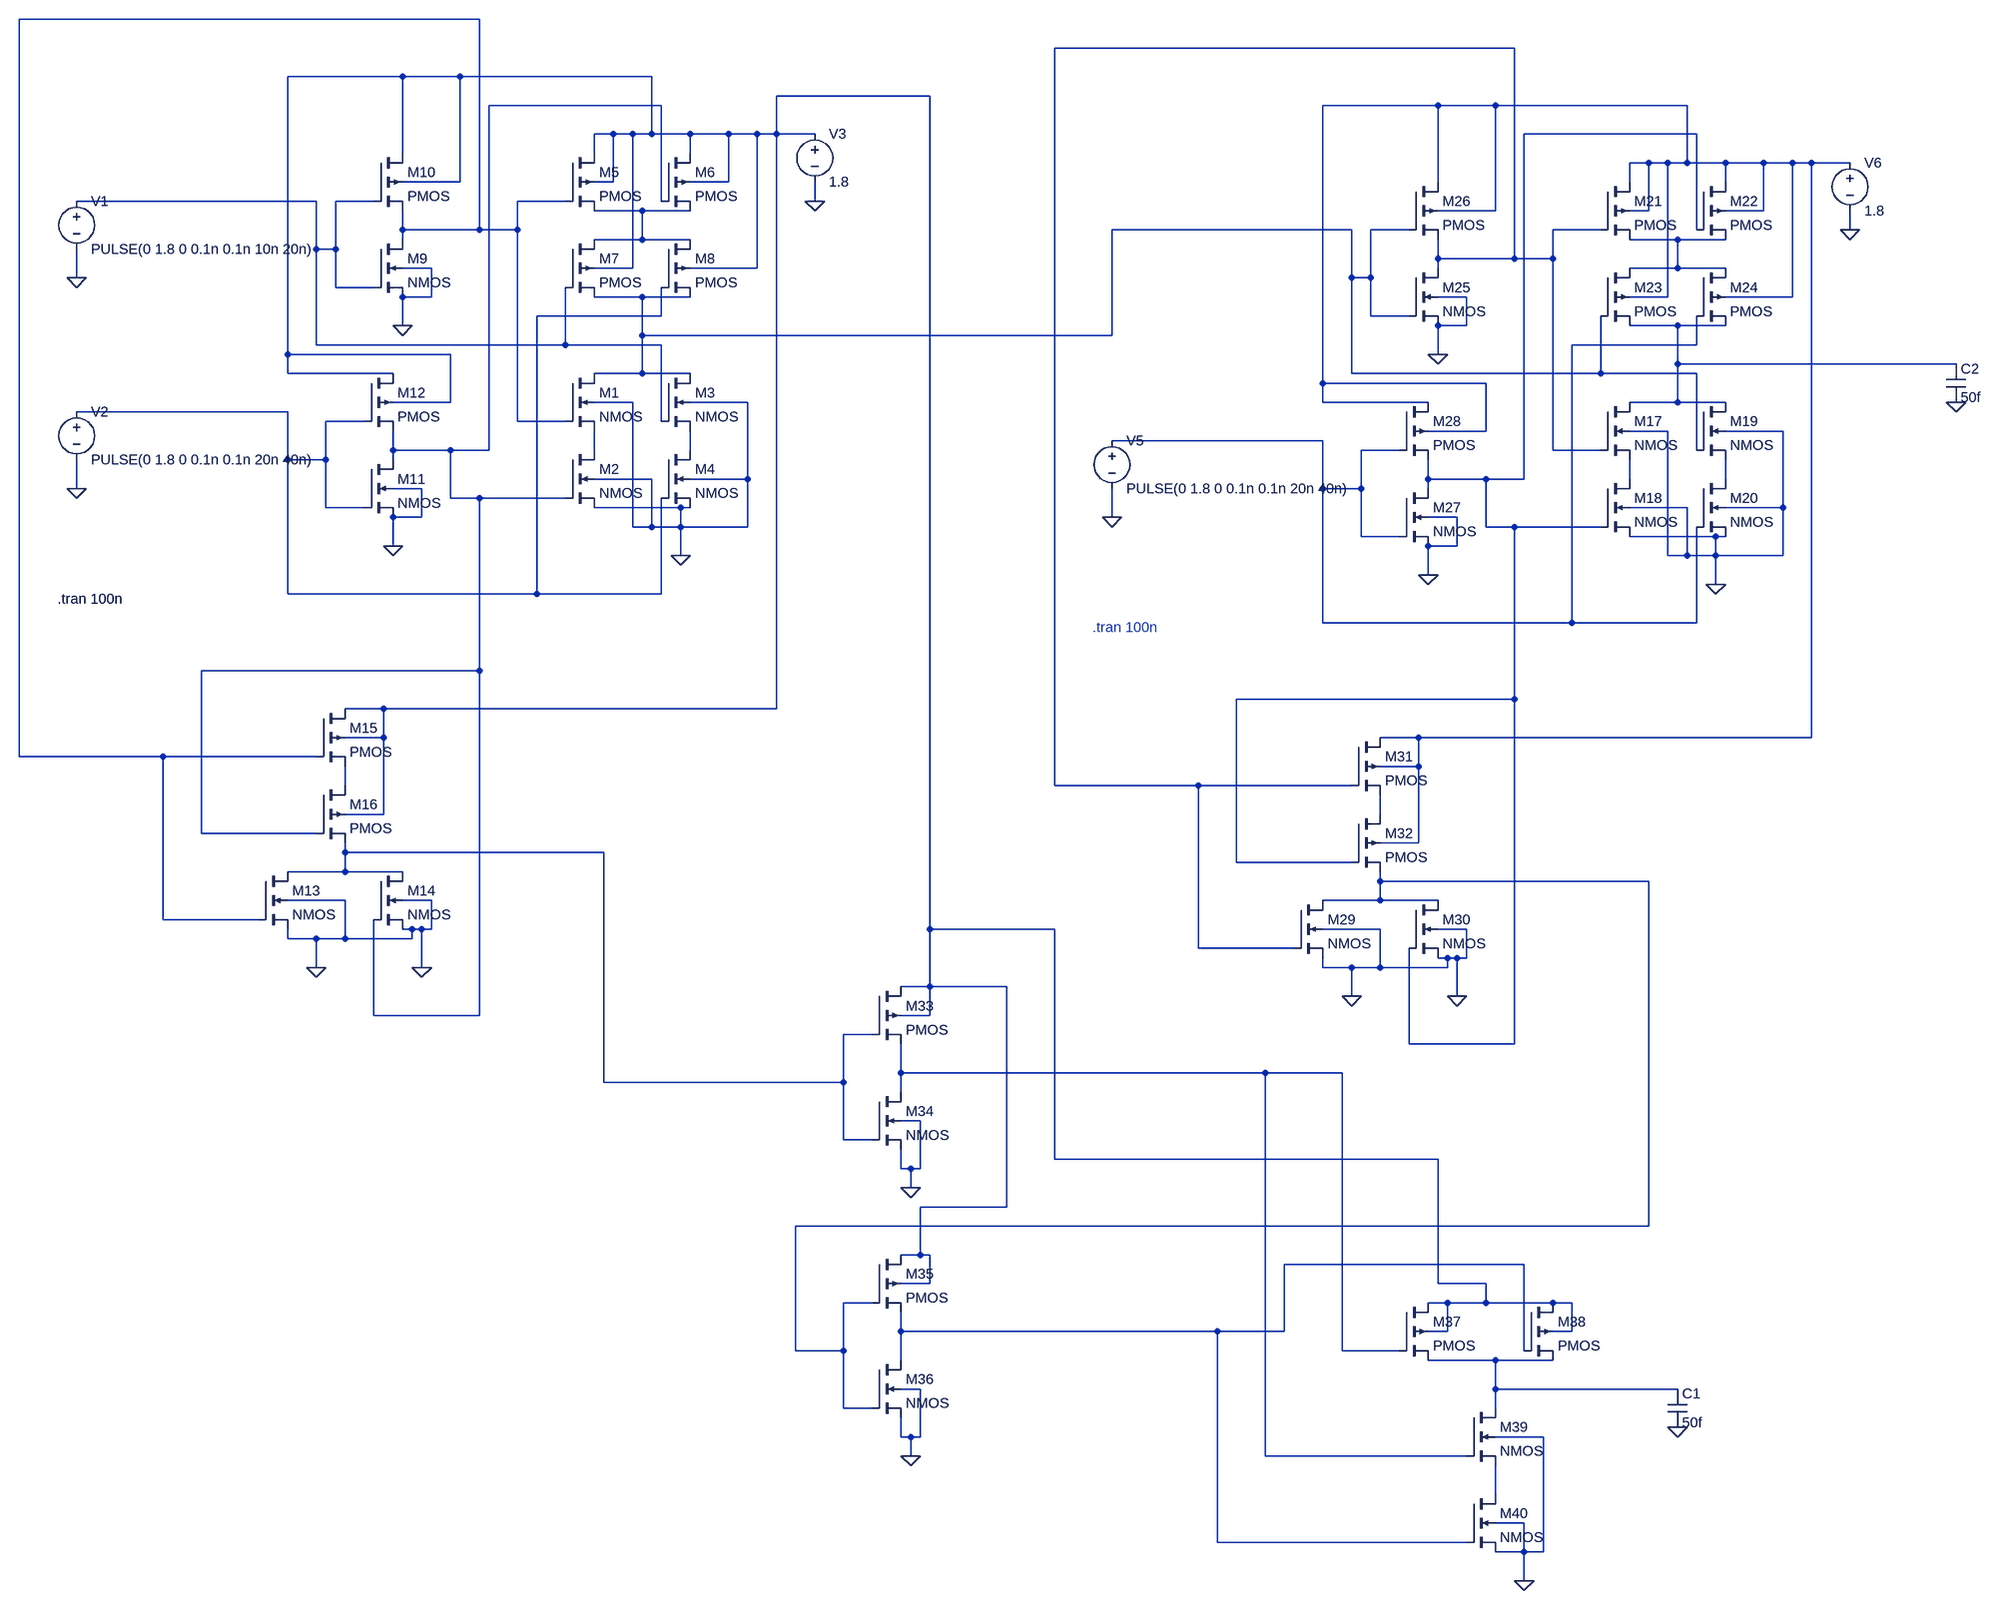
[diagram p0: schematic full adder.asc]
full adder.asc, the LTspice schematic file:
Version 4.1
SHEET 1 2688 2308
WIRE 16 -320 -752 -320
WIRE 1744 -272 976 -272
WIRE -112 -224 -304 -224
WIRE -16 -224 -112 -224
WIRE 304 -224 -16 -224
WIRE 768 -192 512 -192
WIRE 320 -176 32 -176
WIRE 1616 -176 1424 -176
WIRE 1712 -176 1616 -176
WIRE 2032 -176 1712 -176
WIRE 240 -128 208 -128
WIRE 272 -128 240 -128
WIRE 304 -128 304 -224
WIRE 304 -128 272 -128
WIRE 368 -128 304 -128
WIRE 432 -128 368 -128
WIRE 480 -128 432 -128
WIRE 512 -128 512 -192
WIRE 512 -128 480 -128
WIRE 576 -128 512 -128
WIRE 2048 -128 1760 -128
WIRE -112 -96 -112 -224
WIRE 208 -96 208 -128
WIRE 368 -96 368 -128
WIRE 1968 -80 1936 -80
WIRE 2000 -80 1968 -80
WIRE 2032 -80 2032 -176
WIRE 2032 -80 2000 -80
WIRE 2096 -80 2032 -80
WIRE 2160 -80 2096 -80
WIRE 2208 -80 2160 -80
WIRE 2240 -80 2208 -80
WIRE 2304 -80 2240 -80
WIRE -16 -48 -16 -224
WIRE -16 -48 -112 -48
WIRE 240 -48 240 -128
WIRE 240 -48 208 -48
WIRE 432 -48 432 -128
WIRE 432 -48 368 -48
WIRE 1616 -48 1616 -176
WIRE 1936 -48 1936 -80
WIRE 2096 -48 2096 -80
WIRE -256 -16 -656 -16
WIRE -160 -16 -224 -16
WIRE 160 -16 80 -16
WIRE 320 -16 320 -176
WIRE 576 -16 576 -48
WIRE 288 0 208 0
WIRE 368 0 288 0
WIRE 1712 0 1712 -176
WIRE 1712 0 1616 0
WIRE 1968 0 1968 -80
WIRE 1968 0 1936 0
WIRE 2160 0 2160 -80
WIRE 2160 0 2096 0
WIRE -112 32 -112 0
WIRE 16 32 16 -320
WIRE 16 32 -112 32
WIRE 80 32 80 -16
WIRE 80 32 16 32
WIRE 1472 32 1072 32
WIRE 1568 32 1504 32
WIRE 1888 32 1808 32
WIRE 2048 32 2048 -128
WIRE 2304 32 2304 0
WIRE -112 48 -112 32
WIRE 288 48 288 0
WIRE 288 48 208 48
WIRE 368 48 288 48
WIRE 2016 48 1936 48
WIRE 2096 48 2016 48
WIRE -256 64 -256 -16
WIRE -224 64 -224 -16
WIRE -224 64 -256 64
WIRE 1616 80 1616 48
WIRE 1744 80 1744 -272
WIRE 1744 80 1616 80
WIRE 1808 80 1808 32
WIRE 1808 80 1744 80
WIRE -64 96 -112 96
WIRE 272 96 272 -128
WIRE 272 96 208 96
WIRE 480 96 480 -128
WIRE 480 96 368 96
WIRE 1616 96 1616 80
WIRE 2016 96 2016 48
WIRE 2016 96 1936 96
WIRE 2096 96 2016 96
WIRE -656 112 -656 64
WIRE 1472 112 1472 32
WIRE 1504 112 1504 32
WIRE 1504 112 1472 112
WIRE -224 128 -224 64
WIRE -160 128 -224 128
WIRE -64 144 -64 96
WIRE -64 144 -112 144
WIRE 288 144 208 144
WIRE 368 144 288 144
WIRE 1664 144 1616 144
WIRE 2000 144 2000 -80
WIRE 2000 144 1936 144
WIRE 2208 144 2208 -80
WIRE 2208 144 2096 144
WIRE 320 176 320 128
WIRE 320 176 112 176
WIRE 1504 176 1504 112
WIRE 1568 176 1504 176
WIRE -112 192 -112 144
WIRE 1664 192 1664 144
WIRE 1664 192 1616 192
WIRE 2016 192 1936 192
WIRE 2096 192 2016 192
WIRE 288 208 288 144
WIRE 1072 208 1072 32
WIRE 1072 208 288 208
WIRE -256 224 -256 64
WIRE 160 224 160 128
WIRE 160 224 -256 224
WIRE 320 224 160 224
WIRE 2048 224 2048 176
WIRE 2048 224 1840 224
WIRE -304 240 -304 -224
WIRE -32 240 -304 240
WIRE 1616 240 1616 192
WIRE 2016 256 2016 192
WIRE 2576 256 2016 256
WIRE -304 272 -304 240
WIRE -128 272 -304 272
WIRE 288 272 288 208
WIRE 288 272 208 272
WIRE 368 272 288 272
WIRE 1472 272 1472 112
WIRE 1888 272 1888 176
WIRE 1888 272 1472 272
WIRE 2048 272 1888 272
WIRE 1424 288 1424 -176
WIRE 1696 288 1424 288
WIRE -32 320 -32 240
WIRE -32 320 -128 320
WIRE 272 320 208 320
WIRE 464 320 368 320
WIRE 1424 320 1424 288
WIRE 1600 320 1424 320
WIRE 2016 320 2016 256
WIRE 2016 320 1936 320
WIRE 2096 320 2016 320
WIRE -304 336 -656 336
WIRE -176 352 -240 352
WIRE 80 352 80 32
WIRE 160 352 80 352
WIRE 320 352 320 224
WIRE 1696 368 1696 288
WIRE 1696 368 1600 368
WIRE 2000 368 1936 368
WIRE 2192 368 2096 368
WIRE 1424 384 1072 384
WIRE -128 400 -128 368
WIRE -32 400 -128 400
WIRE 32 400 32 -176
WIRE 32 400 -32 400
WIRE 208 400 208 368
WIRE 368 400 368 368
WIRE 1552 400 1488 400
WIRE 1808 400 1808 80
WIRE 1888 400 1808 400
WIRE 2048 400 2048 272
WIRE -304 416 -304 336
WIRE -240 416 -240 352
WIRE -240 416 -304 416
WIRE -128 416 -128 400
WIRE 304 448 208 448
WIRE 464 448 464 320
WIRE 464 448 368 448
WIRE 1600 448 1600 416
WIRE 1696 448 1600 448
WIRE 1760 448 1760 -128
WIRE 1760 448 1696 448
WIRE 1936 448 1936 416
WIRE 2096 448 2096 416
WIRE -656 464 -656 416
WIRE -80 464 -128 464
WIRE 1424 464 1424 384
WIRE 1488 464 1488 400
WIRE 1488 464 1424 464
WIRE 1600 464 1600 448
WIRE -32 480 -32 400
WIRE 16 480 -32 480
WIRE 160 480 16 480
WIRE -240 496 -240 416
WIRE -176 496 -240 496
WIRE 352 496 208 496
WIRE 368 496 352 496
WIRE 2032 496 1936 496
WIRE 2192 496 2192 368
WIRE 2192 496 2096 496
WIRE -80 512 -80 464
WIRE -80 512 -128 512
WIRE 1072 512 1072 464
WIRE 1648 512 1600 512
WIRE 272 528 272 320
WIRE 304 528 304 448
WIRE 304 528 272 528
WIRE 352 528 352 496
WIRE 352 528 304 528
WIRE 464 528 464 448
WIRE 464 528 352 528
WIRE 1696 528 1696 448
WIRE 1744 528 1696 528
WIRE 1888 528 1744 528
WIRE 1488 544 1488 464
WIRE 1552 544 1488 544
WIRE 2080 544 1936 544
WIRE 2096 544 2080 544
WIRE -128 560 -128 512
WIRE 1648 560 1648 512
WIRE 1648 560 1600 560
WIRE 352 576 352 528
WIRE 2000 576 2000 368
WIRE 2032 576 2032 496
WIRE 2032 576 2000 576
WIRE 2080 576 2080 544
WIRE 2080 576 2032 576
WIRE 2192 576 2192 496
WIRE 2192 576 2080 576
WIRE 1600 608 1600 560
WIRE 2080 624 2080 576
WIRE -304 640 -304 416
WIRE 112 640 112 176
WIRE 112 640 -304 640
WIRE 320 640 320 480
WIRE 320 640 112 640
WIRE 1424 688 1424 464
WIRE 1840 688 1840 224
WIRE 1840 688 1424 688
WIRE 2048 688 2048 528
WIRE 2048 688 1840 688
WIRE 16 768 16 480
WIRE 16 768 -448 768
WIRE 1744 816 1744 528
WIRE 1744 816 1280 816
WIRE -144 832 -208 832
WIRE 512 832 512 -128
WIRE 512 832 -144 832
WIRE -144 880 -144 832
WIRE -144 880 -208 880
WIRE 1584 880 1520 880
WIRE 2240 880 2240 -80
WIRE 2240 880 1584 880
WIRE -752 912 -752 -320
WIRE -512 912 -752 912
WIRE -256 912 -512 912
WIRE 1584 928 1584 880
WIRE 1584 928 1520 928
WIRE -208 960 -208 928
WIRE 976 960 976 -272
WIRE 1216 960 976 960
WIRE 1472 960 1216 960
WIRE -144 1008 -144 880
WIRE -144 1008 -208 1008
WIRE 1520 1008 1520 976
WIRE -448 1040 -448 768
WIRE -256 1040 -448 1040
WIRE 1584 1056 1584 928
WIRE 1584 1056 1520 1056
WIRE -208 1072 -208 1056
WIRE 224 1072 -208 1072
WIRE 1280 1088 1280 816
WIRE 1472 1088 1280 1088
WIRE -208 1104 -208 1072
WIRE -208 1104 -304 1104
WIRE -112 1104 -208 1104
WIRE 1520 1120 1520 1104
WIRE 1968 1120 1520 1120
WIRE -208 1152 -304 1152
WIRE -64 1152 -112 1152
WIRE 1520 1152 1520 1120
WIRE 1520 1152 1424 1152
WIRE 1616 1152 1520 1152
WIRE -512 1184 -512 912
WIRE -352 1184 -512 1184
WIRE -96 1200 -112 1200
WIRE -80 1200 -96 1200
WIRE -64 1200 -64 1152
WIRE -64 1200 -80 1200
WIRE 768 1200 768 -192
WIRE 976 1200 768 1200
WIRE 1520 1200 1424 1200
WIRE 1664 1200 1616 1200
WIRE -304 1216 -304 1200
WIRE -256 1216 -304 1216
WIRE -208 1216 -208 1152
WIRE -208 1216 -256 1216
WIRE -96 1216 -96 1200
WIRE -96 1216 -208 1216
WIRE 1216 1232 1216 960
WIRE 1376 1232 1216 1232
WIRE 1632 1248 1616 1248
WIRE 1648 1248 1632 1248
WIRE 1664 1248 1664 1200
WIRE 1664 1248 1648 1248
WIRE -256 1264 -256 1216
WIRE -80 1264 -80 1200
WIRE 1424 1264 1424 1248
WIRE 1472 1264 1424 1264
WIRE 1520 1264 1520 1200
WIRE 1520 1264 1472 1264
WIRE 1632 1264 1632 1248
WIRE 1632 1264 1520 1264
WIRE 768 1296 768 1200
WIRE 768 1296 720 1296
WIRE 896 1296 768 1296
WIRE 1472 1312 1472 1264
WIRE 1648 1312 1648 1248
WIRE -160 1344 -160 1184
WIRE 16 1344 16 768
WIRE 16 1344 -160 1344
WIRE 768 1344 768 1296
WIRE 768 1344 720 1344
WIRE 672 1376 624 1376
WIRE 1568 1392 1568 1232
WIRE 1744 1392 1744 816
WIRE 1744 1392 1568 1392
WIRE 720 1440 720 1392
WIRE 1328 1440 720 1440
WIRE 1456 1440 1328 1440
WIRE 224 1456 224 1072
WIRE 624 1456 624 1376
WIRE 624 1456 224 1456
WIRE 720 1472 720 1440
WIRE 752 1520 720 1520
WIRE 624 1552 624 1456
WIRE 672 1552 624 1552
WIRE 976 1584 976 1200
WIRE 1616 1584 976 1584
WIRE 720 1600 720 1568
WIRE 736 1600 720 1600
WIRE 752 1600 752 1520
WIRE 752 1600 736 1600
WIRE 736 1632 736 1600
WIRE 896 1664 896 1296
WIRE 896 1664 752 1664
WIRE 1968 1696 1968 1120
WIRE 1968 1696 544 1696
WIRE 752 1744 752 1664
WIRE 752 1744 720 1744
WIRE 768 1744 752 1744
WIRE 1760 1760 1360 1760
WIRE 768 1792 768 1744
WIRE 768 1792 720 1792
WIRE 1616 1792 1616 1584
WIRE 1696 1792 1616 1792
WIRE 672 1824 624 1824
WIRE 1632 1824 1600 1824
WIRE 1696 1824 1696 1792
WIRE 1696 1824 1632 1824
WIRE 1808 1824 1696 1824
WIRE 1840 1824 1808 1824
WIRE 720 1872 720 1840
WIRE 1248 1872 720 1872
WIRE 1360 1872 1360 1760
WIRE 1360 1872 1248 1872
WIRE 1632 1872 1632 1824
WIRE 1632 1872 1600 1872
WIRE 1840 1872 1840 1824
WIRE 1840 1872 1808 1872
WIRE 544 1904 544 1696
WIRE 624 1904 624 1824
WIRE 624 1904 544 1904
WIRE 1456 1904 1456 1440
WIRE 1552 1904 1456 1904
WIRE 1760 1904 1760 1760
WIRE 720 1920 720 1872
WIRE 1712 1920 1600 1920
WIRE 1808 1920 1712 1920
WIRE 752 1968 720 1968
WIRE 1712 1968 1712 1920
WIRE 2016 1968 1712 1968
WIRE 624 2000 624 1904
WIRE 672 2000 624 2000
WIRE 1712 2000 1712 1968
WIRE 720 2048 720 2016
WIRE 736 2048 720 2048
WIRE 752 2048 752 1968
WIRE 752 2048 736 2048
WIRE 1792 2048 1712 2048
WIRE 736 2080 736 2048
WIRE 1328 2080 1328 1440
WIRE 1664 2080 1328 2080
WIRE 1712 2144 1712 2096
WIRE 1760 2192 1712 2192
WIRE 1248 2224 1248 1872
WIRE 1664 2224 1248 2224
WIRE 1760 2240 1760 2192
WIRE 1760 2240 1712 2240
WIRE 1792 2240 1792 2048
WIRE 1792 2240 1760 2240
WIRE 1760 2288 1760 2240
FLAG -112 192 0
FLAG -128 560 0
FLAG 352 576 0
FLAG -656 112 0
FLAG -656 464 0
FLAG 576 -16 0
FLAG -256 1264 0
FLAG -80 1264 0
FLAG 1616 240 0
FLAG 1600 608 0
FLAG 2080 624 0
FLAG 1072 512 0
FLAG 2304 32 0
FLAG 1472 1312 0
FLAG 1648 1312 0
FLAG 736 1632 0
FLAG 736 2080 0
FLAG 1760 2288 0
FLAG 2016 2032 0
FLAG 2576 320 0
SYMBOL nmos4 160 272 R0
SYMATTR InstName M1
SYMATTR Value2 l=180n w=270n
SYMBOL nmos4 160 400 R0
SYMATTR InstName M2
SYMATTR Value2 l=180n w=270n
SYMBOL nmos4 320 272 R0
SYMATTR InstName M3
SYMATTR Value2 l=180n w=270n
SYMBOL nmos4 320 400 R0
SYMATTR InstName M4
SYMATTR Value2 l=180n w=270n
SYMBOL pmos4 160 -96 R0
SYMATTR InstName M5
SYMATTR Value2 l=180n w=810n
SYMBOL pmos4 320 -96 R0
SYMATTR InstName M6
SYMATTR Value2 l=180n w=810n
SYMBOL pmos4 160 48 R0
SYMATTR InstName M7
SYMATTR Value2 l=180n w=810n
SYMBOL pmos4 320 48 R0
SYMATTR InstName M8
SYMATTR Value2 l=180n w=810n
SYMBOL nmos4 -160 48 R0
SYMATTR InstName M9
SYMATTR Value2 l=180n w=270n
SYMBOL pmos4 -160 -96 R0
SYMATTR InstName M10
SYMATTR Value2 l=180n w=810n
SYMBOL nmos4 -176 416 R0
SYMATTR InstName M11
SYMATTR Value2 l=180n w=270n
SYMBOL pmos4 -176 272 R0
SYMATTR InstName M12
SYMATTR Value2 l=180n w=810n
SYMBOL voltage -656 -32 R0
WINDOW 123 0 0 Left 0
WINDOW 39 0 0 Left 0
SYMATTR InstName V1
SYMATTR Value PULSE(0 1.8 0 0.1n 0.1n 10n 20n)
SYMBOL voltage -656 320 R0
WINDOW 123 0 0 Left 0
WINDOW 39 0 0 Left 0
SYMATTR InstName V2
SYMATTR Value PULSE(0 1.8 0 0.1n 0.1n 20n 40n)
SYMBOL voltage 576 -144 R0
WINDOW 123 0 0 Left 0
WINDOW 39 0 0 Left 0
SYMATTR InstName V3
SYMATTR Value 1.8
SYMBOL nmos4 -352 1104 R0
SYMATTR InstName M13
SYMATTR Value2 l=180n w=270n
SYMBOL nmos4 -160 1104 R0
SYMATTR InstName M14
SYMATTR Value2 l=180n w=270n
SYMBOL pmos4 -256 832 R0
SYMATTR InstName M15
SYMATTR Value2 l=180n w=810n
SYMBOL pmos4 -256 960 R0
SYMATTR InstName M16
SYMATTR Value2 l=180n w=810n
SYMBOL nmos4 1888 320 R0
SYMATTR InstName M17
SYMATTR Value2 l=180n w=270n
SYMBOL nmos4 1888 448 R0
SYMATTR InstName M18
SYMATTR Value2 l=180n w=270n
SYMBOL nmos4 2048 320 R0
SYMATTR InstName M19
SYMATTR Value2 l=180n w=270n
SYMBOL nmos4 2048 448 R0
SYMATTR InstName M20
SYMATTR Value2 l=180n w=270n
SYMBOL pmos4 1888 -48 R0
SYMATTR InstName M21
SYMATTR Value2 l=180n w=810n
SYMBOL pmos4 2048 -48 R0
SYMATTR InstName M22
SYMATTR Value2 l=180n w=810n
SYMBOL pmos4 1888 96 R0
SYMATTR InstName M23
SYMATTR Value2 l=180n w=810n
SYMBOL pmos4 2048 96 R0
SYMATTR InstName M24
SYMATTR Value2 l=180n w=810n
SYMBOL nmos4 1568 96 R0
SYMATTR InstName M25
SYMATTR Value2 l=180n w=270n
SYMBOL pmos4 1568 -48 R0
SYMATTR InstName M26
SYMATTR Value2 l=180n w=810n
SYMBOL nmos4 1552 464 R0
SYMATTR InstName M27
SYMATTR Value2 l=180n w=270n
SYMBOL pmos4 1552 320 R0
SYMATTR InstName M28
SYMATTR Value2 l=180n w=810n
SYMBOL voltage 1072 368 R0
WINDOW 123 0 0 Left 0
WINDOW 39 0 0 Left 0
SYMATTR InstName V5
SYMATTR Value PULSE(0 1.8 0 0.1n 0.1n 20n 40n)
SYMBOL voltage 2304 -96 R0
WINDOW 123 0 0 Left 0
WINDOW 39 0 0 Left 0
SYMATTR InstName V6
SYMATTR Value 1.8
SYMBOL nmos4 1376 1152 R0
SYMATTR InstName M29
SYMATTR Value2 l=180n w=270n
SYMBOL nmos4 1568 1152 R0
SYMATTR InstName M30
SYMATTR Value2 l=180n w=270n
SYMBOL pmos4 1472 880 R0
SYMATTR InstName M31
SYMATTR Value2 l=180n w=810n
SYMBOL pmos4 1472 1008 R0
SYMATTR InstName M32
SYMATTR Value2 l=180n w=810n
SYMBOL pmos4 672 1296 R0
SYMATTR InstName M33
SYMATTR Value2 l=180n w=810n
SYMBOL nmos4 672 1472 R0
SYMATTR InstName M34
SYMATTR Value2 l=180n w=270n
SYMBOL pmos4 672 1744 R0
SYMATTR InstName M35
SYMATTR Value2 l=180n w=810n
SYMBOL nmos4 672 1920 R0
SYMATTR InstName M36
SYMATTR Value2 l=180n w=270n
SYMBOL pmos4 1552 1824 R0
SYMATTR InstName M37
SYMATTR Value2 l=180n w=810n
SYMBOL pmos4 1760 1824 R0
SYMATTR InstName M38
SYMATTR Value2 l=180n w=810n
SYMBOL nmos4 1664 2000 R0
SYMATTR InstName M39
SYMATTR Value2 l=180n w=270n
SYMBOL nmos4 1664 2144 R0
SYMATTR InstName M40
SYMATTR Value2 l=180n w=270n
SYMBOL cap 2000 1968 R0
SYMATTR InstName C1
SYMATTR Value 50f
SYMBOL cap 2560 256 R0
SYMATTR InstName C2
SYMATTR Value 50f
TEXT -688 648 Left 2 !.tran 100n
TEXT 1040 696 Left 2 ;.tran 100n

The netlist it stands for:
* full adder.asc
M1 N009 N001 N014 0 NMOS l=180n w=270n
M2 N014 N004 0 0 NMOS l=180n w=270n
M3 N009 N007 N015 0 NMOS l=180n w=270n
M4 N015 N011 0 0 NMOS l=180n w=270n
M5 N003 N001 N008 N003 PMOS l=180n w=810n
M6 N003 N004 N008 N003 PMOS l=180n w=810n
M7 N008 N007 N009 N003 PMOS l=180n w=810n
M8 N008 N011 N009 N003 PMOS l=180n w=810n
M9 N001 N007 0 0 NMOS l=180n w=270n
M10 N003 N007 N001 N003 PMOS l=180n w=810n
M11 N004 N011 0 0 NMOS l=180n w=270n
M12 N003 N011 N004 N003 PMOS l=180n w=810n
V1 N007 0 PULSE(0 1.8 0 0.1n 0.1n 10n 20n)
V2 N011 0 PULSE(0 1.8 0 0.1n 0.1n 20n 40n)
V3 N003 0 1.8
M13 N020 N001 0 0 NMOS l=180n w=270n
M14 N020 N004 0 0 NMOS l=180n w=270n
M15 N003 N001 N018 N003 PMOS l=180n w=810n
M16 N018 N004 N020 N003 PMOS l=180n w=810n
M17 N012 N002 N016 0 NMOS l=180n w=270n
M18 N016 N006 0 0 NMOS l=180n w=270n
M19 N012 N009 N017 0 NMOS l=180n w=270n
M20 N017 N013 0 0 NMOS l=180n w=270n
M21 N005 N002 N010 N005 PMOS l=180n w=810n
M22 N005 N006 N010 N005 PMOS l=180n w=810n
M23 N010 N009 N012 N005 PMOS l=180n w=810n
M24 N010 N013 N012 N005 PMOS l=180n w=810n
M25 N002 N009 0 0 NMOS l=180n w=270n
M26 N005 N009 N002 N005 PMOS l=180n w=810n
M27 N006 N013 0 0 NMOS l=180n w=270n
M28 N005 N013 N006 N005 PMOS l=180n w=810n
V5 N013 0 PULSE(0 1.8 0 0.1n 0.1n 20n 40n)
V6 N005 0 1.8
M29 N021 N002 0 0 NMOS l=180n w=270n
M30 N021 N006 0 0 NMOS l=180n w=270n
M31 N005 N002 N019 N005 PMOS l=180n w=810n
M32 N019 N006 N021 N005 PMOS l=180n w=810n
M33 N003 N020 N022 N003 PMOS l=180n w=810n
M34 N022 N020 0 0 NMOS l=180n w=270n
M35 N003 N021 N023 N003 PMOS l=180n w=810n
M36 N023 N021 0 0 NMOS l=180n w=270n
M37 N003 N022 N024 N003 PMOS l=180n w=810n
M38 N003 N023 N024 N003 PMOS l=180n w=810n
M39 N024 N022 N025 0 NMOS l=180n w=270n
M40 N025 N023 0 0 NMOS l=180n w=270n
C1 N024 0 50f
C2 N012 0 50f
.model NMOS NMOS
.model PMOS PMOS
.lib standard.mos
.tran 100n
* .tran 100n
.backanno
.end